# Altium schematic sheet 原理图v1.2.SchDoc
size A3
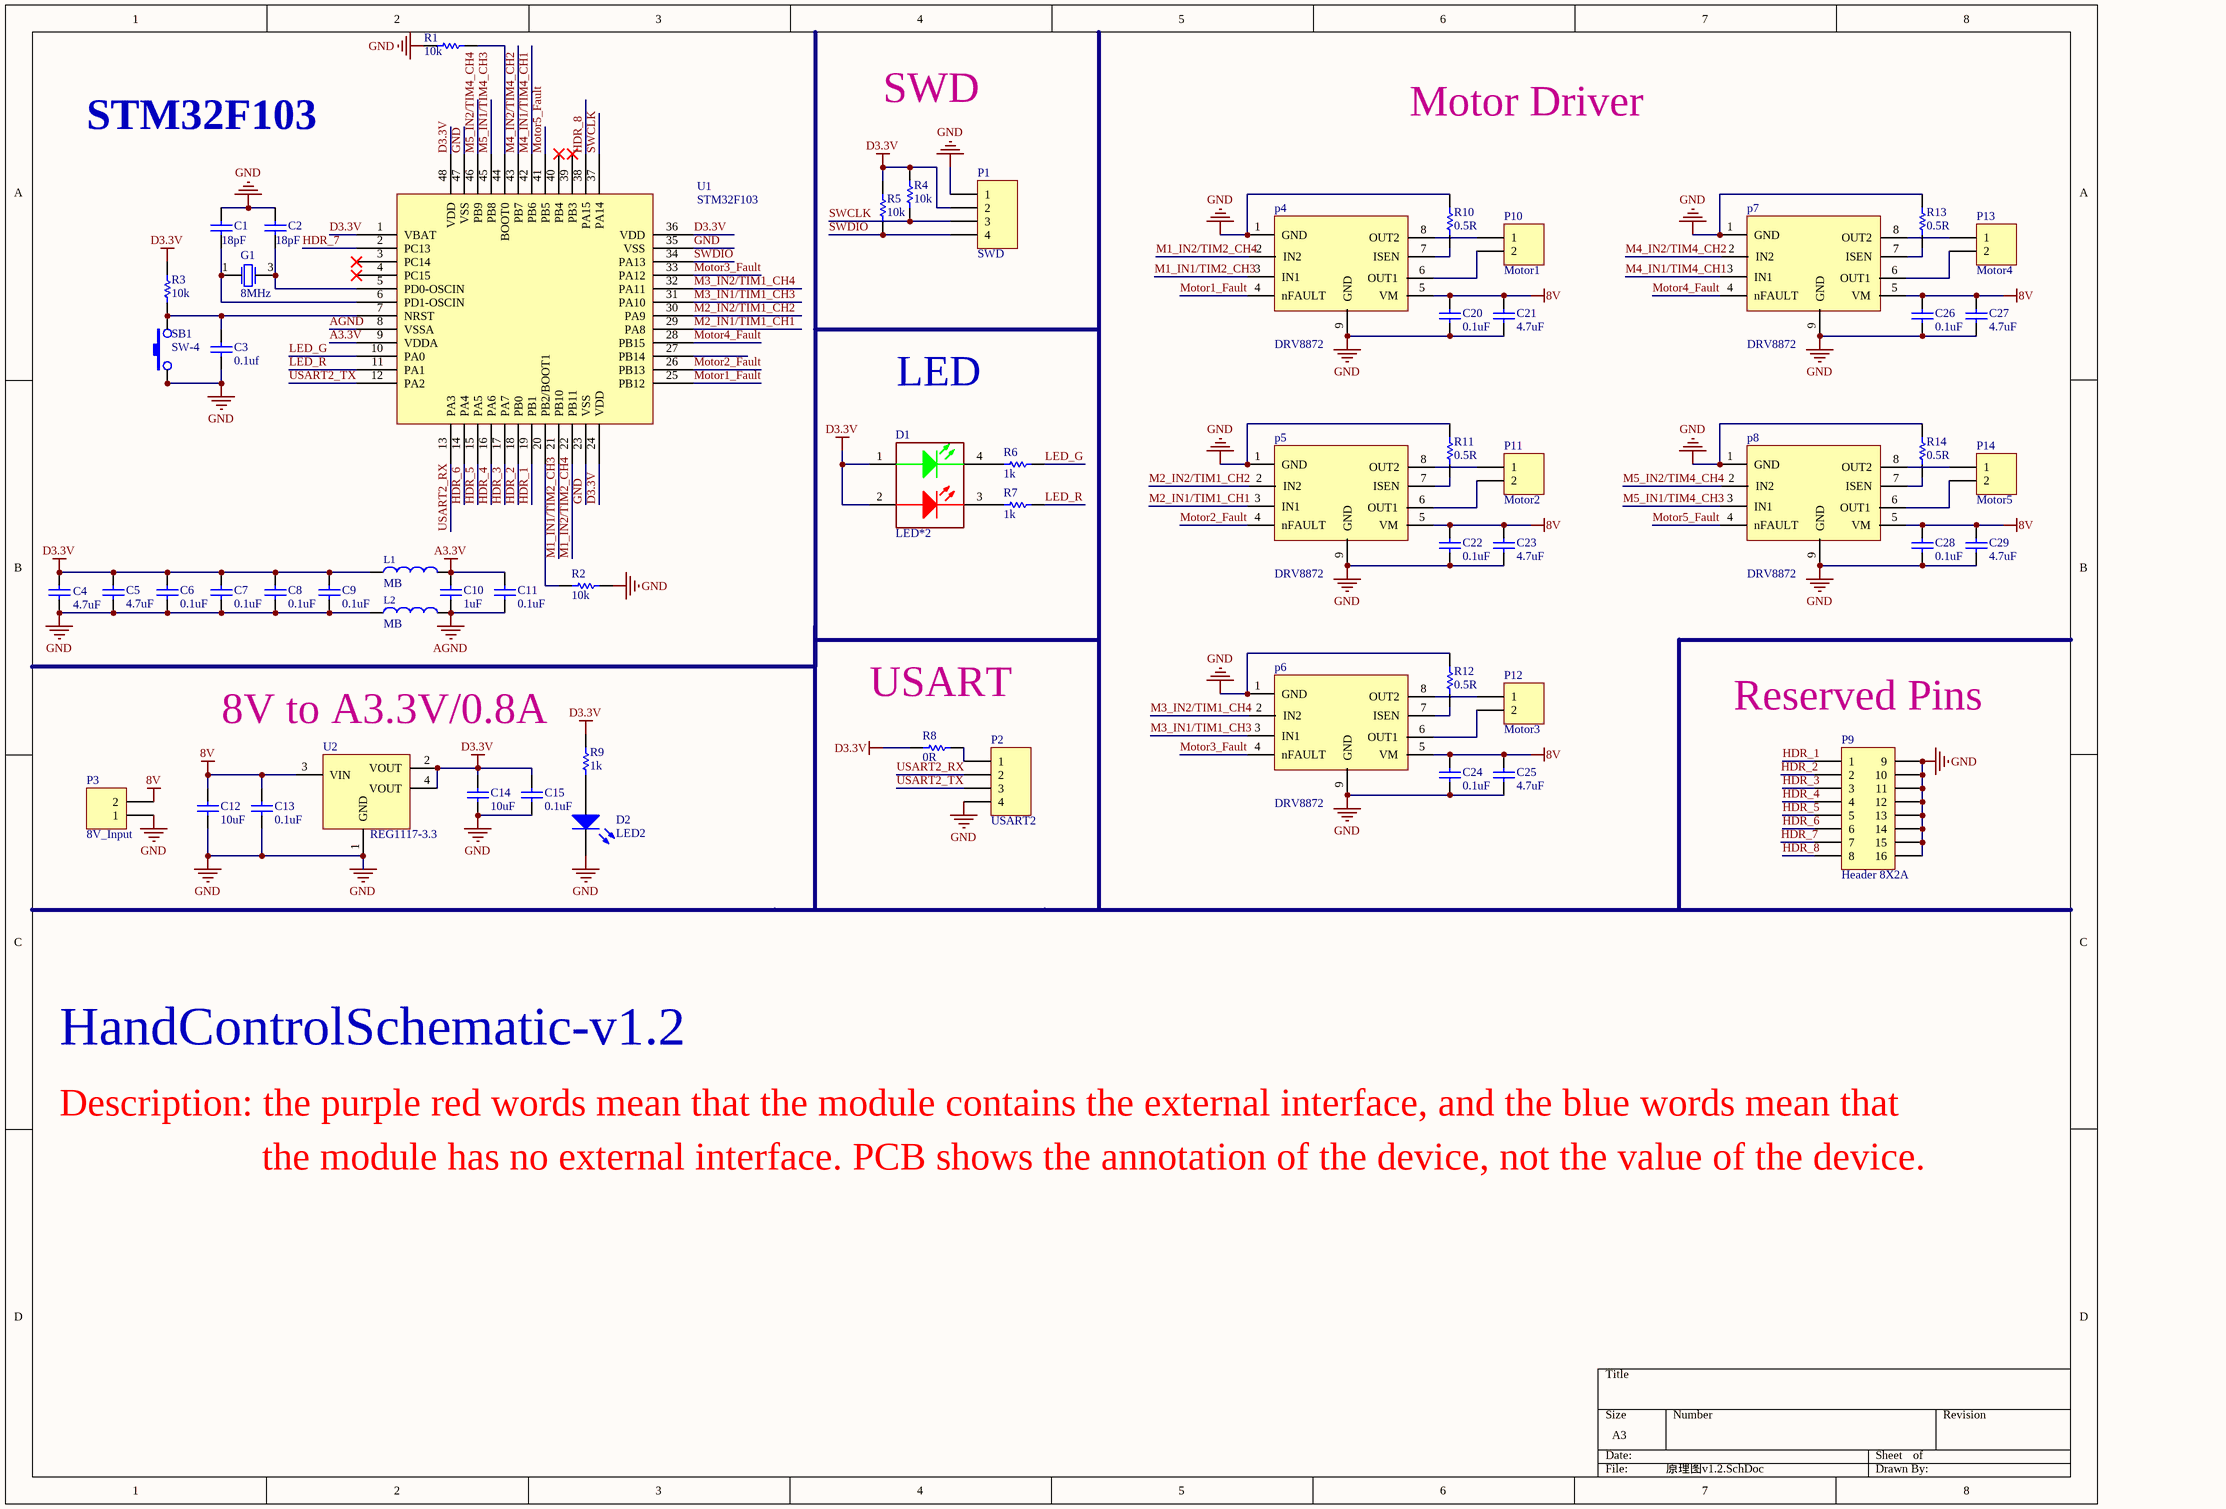
[diagram p0: 原理图v1.2.SchDoc]

## Parts
C1  18pf  [0603]
C2  18pf  [0603]
C3  0.1uf  [0603]
C4  4.7uf  [0603]
C5  4.7uf  [0603]
C6  0.1uf  [0603]
C7  0.1uf  [0603]
C8  0.1uf  [0603]
C9  0.1uf  [0603]
C10  1uf  [0603]
C11  0.1uf  [0603]
C12  10uf  [0603]
C13  0.1uf  [0603]
C14  10uf  [0603]
C15  0.1uf  [0603]
C20  0.1uf  [0603]
C21  4.7uf  [0603]
C22  0.1uf  [0603]
C23  4.7uf  [0603]
C24  0.1uf  [0603]
C25  4.7uf  [0603]
C26  0.1uf  [0603]
C27  4.7uf  [0603]
C28  0.1uf  [0603]
C29  4.7uf  [0603]
D1  LED*2  [1206LED*2]
D2  LED2  [0603]
G1  8MHz  [3225OSC]
L1  MB  [0603]
L2  MB  [0603]
P1  SWD  [GH1.25-4P]
P2  USART2  [GH1.25-4P]
P3  8V_Input  [HDR1X2]
p4  DRV8872  [SOP8-PowerPAD]
p5  DRV8872  [SOP8-PowerPAD]
p6  DRV8872  [SOP8-PowerPAD]
p7  DRV8872  [SOP8-PowerPAD]
p8  DRV8872  [SOP8-PowerPAD]
P9  Header 8X2A  [HDR2X8_CEN]
P10  Motor1  [HDR1X2]
P11  Motor2  [HDR1X2]
P12  Motor3  [HDR1X2]
P13  Motor4  [HDR1X2]
P14  Motor5  [HDR1X2]
R1  10k  [0603]
R2  10k  [0603]
R3  10k  [0603]
R4  10k  [0603]
R5  10k  [0603]
R6  1k  [0603]
R7  1k  [0603]
R8  0R  [0603]
R9  1k  [0603]
R10  0.5R  [0603]
R11  0.5R  [0603]
R12  0.5R  [0603]
R13  0.5R  [0603]
R14  0.5R  [0603]
SB1  SW-4  [SKRPADE010]
U1  STM32F103  [LQFP48]
U2  REG1117-3.3  [SOT223]

## Nets
8V: C12.2 C13.2 C20.2 C21.2 C22.2 C23.2 C24.2 C25.2 C26.2 C27.2 C28.2 C29.2 P3.2 p4.5(VM) p5.5(VM) p6.5(VM) p7.5(VM) p8.5(VM) U2.3(VIN)
A3.3V: C10.2 C11.2 L1.2 U1.9(VDDA)
AGND: C10.1 C11.1 L2.2 U1.8(VSSA)
D3.3V: C4.2 C5.2 C6.2 C7.2 C8.2 C9.2 C14.2 C15.2 D1.1(A) D1.2(A) L1.1 P1.2 R3.2 R4.2 R5.2 R8.1 R9.2 U1.1(VBAT) U1.24(VDD) U1.36(VDD) U1.48(VDD) U2.2(VOUT) U2.4(VOUT)
GND: C1.2 C2.2 C3.1 C4.1 C5.1 C6.1 C7.1 C8.1 C9.1 C12.1 C13.1 C14.1 C15.1 C20.1 C21.1 C22.1 C23.1 C24.1 C25.1 C26.1 C27.1 C28.1 C29.1 D2.2(K) G1.2 G1.4 L2.1 P1.1 P2.4 P3.1 p4.1(GND) p4.9(GND) p5.1(GND) p5.9(GND) p6.1(GND) p6.9(GND) p7.1(GND) p7.9(GND) p8.1(GND) p8.9(GND) P9.9 P9.10 P9.11 P9.12 P9.13 P9.14 P9.15 P9.16 R1.2 R2.1 R10.2 R11.2 R12.2 R13.2 R14.2 SB1.1 SB1.2 U1.23(VSS) U1.35(VSS) U1.47(VSS) U2.1(GND)
HDR_1: P9.1 U1.19(PB1)
HDR_2: P9.2 U1.18(PB0)
HDR_3: P9.3 U1.17(PA7)
HDR_4: P9.4 U1.16(PA6)
HDR_5: P9.5 U1.15(PA5)
HDR_6: P9.6 U1.14(PA4)
HDR_7: P9.7 U1.2(PC13)
HDR_8: P9.8 U1.38(PA15)
LED_G: R6.2 U1.10(PA0)
LED_R: R7.2 U1.11(PA1)
M1_IN1/TIM2_CH3: p4.3(IN1) U1.21(PB10)
M1_IN2/TIM2_CH4: p4.2(IN2) U1.22(PB11)
M2_IN1/TIM1_CH1: p5.3(IN1) U1.29(PA8)
M2_IN2/TIM1_CH2: p5.2(IN2) U1.30(PA9)
M3_IN1/TIM1_CH3: p6.3(IN1) U1.31(PA10)
M3_IN2/TIM1_CH4: p6.2(IN2) U1.32(PA11)
M4_IN1/TIM4_CH1: p7.3(IN1) U1.42(PB6)
M4_IN2/TIM4_CH2: p7.2(IN2) U1.43(PB7)
M5_IN1/TIM4_CH3: p8.3(IN1) U1.45(PB8)
M5_IN2/TIM4_CH4: p8.2(IN2) U1.46(PB9)
Motor1_Fault: p4.4(nFAULT) U1.25(PB12)
Motor2_Fault: p5.4(nFAULT) U1.26(PB13)
Motor3_Fault: p6.4(nFAULT) U1.33(PA12)
Motor4_Fault: p7.4(nFAULT) U1.28(PB15)
Motor5_Fault: p8.4(nFAULT) U1.41(PB5)
SWCLK: P1.3 R4.1 U1.37(PA14)
SWDIO: P1.4 R5.1 U1.34(PA13)
USART2_RX: P2.2 U1.13(PA3)
USART2_TX: P2.3 U1.12(PA2)
NetC1_1: C1.1 G1.1 U1.6(PD1-OSCIN)
NetC2_1: C2.1 G1.3 U1.5(PD0-OSCIN)
NetC3_2: C3.2 R3.1 SB1.3 SB1.4 U1.7(NRST)
NetD1_3: D1.3(K) R7.1
NetD1_4: D1.4(K) R6.1
NetD2_1: D2.1(A) R9.1
NetP2_1: P2.1 R8.2
Netp4_6: p4.6(OUT1) P10.2
Netp4_7: p4.7(ISEN) R10.1
Netp4_8: p4.8(OUT2) P10.1
Netp5_6: p5.6(OUT1) P11.2
Netp5_7: p5.7(ISEN) R11.1
Netp5_8: p5.8(OUT2) P11.1
Netp6_6: p6.6(OUT1) P12.2
Netp6_7: p6.7(ISEN) R12.1
Netp6_8: p6.8(OUT2) P12.1
Netp7_6: p7.6(OUT1) P13.2
Netp7_7: p7.7(ISEN) R13.1
Netp7_8: p7.8(OUT2) P13.1
Netp8_6: p8.6(OUT1) P14.2
Netp8_7: p8.7(ISEN) R14.1
Netp8_8: p8.8(OUT2) P14.1
NetR1_1: R1.1 U1.44(BOOT0)
NetR2_2: R2.2 U1.20(PB2/BOOT1)

Not connected (* = marked no-connect by the designer): U1 3(PC14)* 4(PC15)* 27(PB14) 39(PB3)* 40(PB4)*

## Notes on the sheet
- SWD
- STM32F103
- Motor Driver
- LED
- USART
- (near P9) Reserved Pins
- 8V to A3.3V/0.8A
- HandControlSchematic-v1.2
- Description: the purple red words mean that the module contains the external interface, and the blue words mean that
- the module has no external interface. PCB shows the annotation of the device, not the value of the device.

## Library data of the parts
C1-C15 C20-C29 = Cap: Capacitor; Published: 8-Jun-2000; Revision: July-2002: Re-released for DXP Platform.; Publisher: Altium Limited
  C1 C2: Value: 18pF
  C3: Value: 0.1uf
  C4 C5 C21 C23 C25 C27 C29: Value: 4.7uF
  C6-C9 C11 C13 C15 C20 C22 C24 C26 C28: Value: 0.1uF
  C10: Value: 1uF
  C12 C14: Value: 10uF
D1 = LED*2: Typical INFRARED GaAs LED; Published: 8-Jun-2000; LatestRevisionDate: 08-Jul-2005; LatestRevisionNote: Mech Layer 1 removed.; PackageReference: LED-0; Publisher: Altium Limited
D2 = LED2: Typical RED, GREEN, YELLOW, AMBER GaAs LED; Published: 8-Jun-2000; LatestRevisionDate: 17-Jul-2002; LatestRevisionNote: Re-released for DXP Platform.; PackageVersion: Feb-2002; PackageReference: 3.2X1.6X1.1; Publisher: Altium Limited; PackageDescription: SM LED; 2 Flat Leads
G1 = 3225OSC: Crystal Oscillator
L1 L2 = INDUCTOR1
P1 P2 = Header 4: Header, 4-Pin; LatestRevisionDate: 17-Jul-2002; LatestRevisionNote: Re-released for DXP Platform.; Publisher: Altium Limited
P3 P10-P14 = Header 2: Header, 2-Pin; LatestRevisionDate: 17-Jul-2002; LatestRevisionNote: Re-released for DXP Platform.; Publisher: Altium Limited
P9 = Header 8X2A: Header, 8-Pin, Dual row; LatestRevisionDate: 17-Jul-2002; LatestRevisionNote: Re-released for DXP Platform.; Publisher: Altium Limited
R1-R14 = Res1: Resistor; Published: 8-Jun-2000; Revision: July-2002: Re-released for DXP Platform.; Publisher: Altium Limited
  R1-R5: Value: 10k
  R6 R7 R9: Value: 1k
  R8: Value: 0R
  R10-R14: Value: 0.5R